# EAGLE design stimMod (EAGLE 8.0.1)
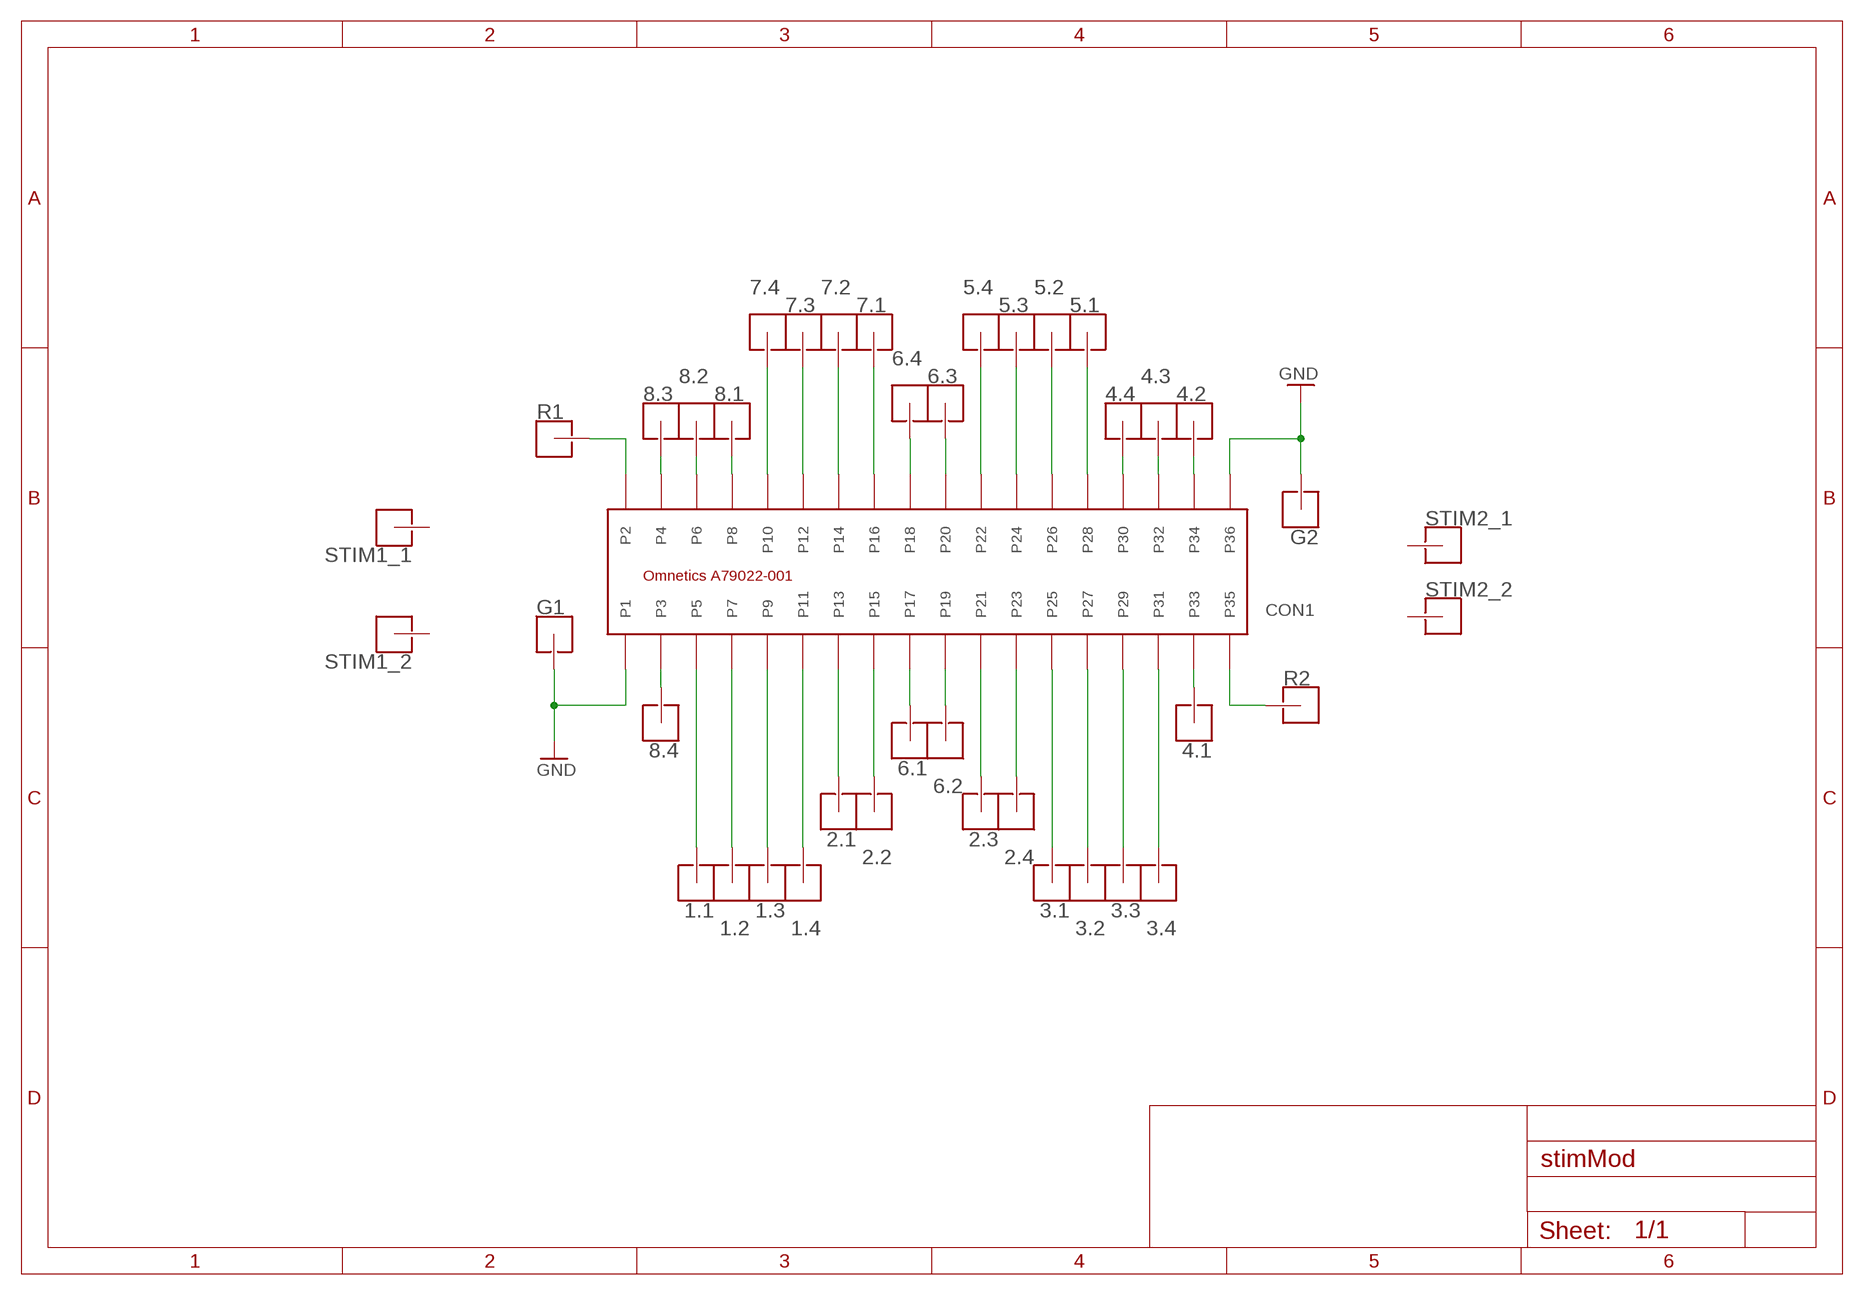
[diagram p0: schematic, sheet 1]

## Parts
1.1  HOLE_L_G_PIN_V5  [LARGE_GOLD_PIN_V5]
1.2  HOLE_L_G_PIN_V5  [LARGE_GOLD_PIN_V5]
1.3  HOLE_L_G_PIN_V5  [LARGE_GOLD_PIN_V5]
1.4  HOLE_L_G_PIN_V5  [LARGE_GOLD_PIN_V5]
2.1  HOLE_L_G_PIN_V5  [LARGE_GOLD_PIN_V5]
2.2  HOLE_L_G_PIN_V5  [LARGE_GOLD_PIN_V5]
2.3  HOLE_L_G_PIN_V5  [LARGE_GOLD_PIN_V5]
2.4  HOLE_L_G_PIN_V5  [LARGE_GOLD_PIN_V5]
3.1  HOLE_L_G_PIN_V5  [LARGE_GOLD_PIN_V5]
3.2  HOLE_L_G_PIN_V5  [LARGE_GOLD_PIN_V5]
3.3  HOLE_L_G_PIN_V5  [LARGE_GOLD_PIN_V5]
3.4  HOLE_L_G_PIN_V5  [LARGE_GOLD_PIN_V5]
4.1  HOLE_L_G_PIN_V5  [LARGE_GOLD_PIN_V5]
4.2  HOLE_L_G_PIN_V5  [LARGE_GOLD_PIN_V5]
4.3  HOLE_L_G_PIN_V5  [LARGE_GOLD_PIN_V5]
4.4  HOLE_L_G_PIN_V5  [LARGE_GOLD_PIN_V5]
5.1  HOLE_L_G_PIN_V5  [LARGE_GOLD_PIN_V5]
5.2  HOLE_L_G_PIN_V5  [LARGE_GOLD_PIN_V5]
5.3  HOLE_L_G_PIN_V5  [LARGE_GOLD_PIN_V5]
5.4  HOLE_L_G_PIN_V5  [LARGE_GOLD_PIN_V5]
6.1  HOLE_L_G_PIN_V5  [LARGE_GOLD_PIN_V5]
6.2  HOLE_L_G_PIN_V5  [LARGE_GOLD_PIN_V5]
6.3  HOLE_L_G_PIN_V5  [LARGE_GOLD_PIN_V5]
6.4  HOLE_L_G_PIN_V5  [LARGE_GOLD_PIN_V5]
7.1  HOLE_L_G_PIN_V5  [LARGE_GOLD_PIN_V5]
7.2  HOLE_L_G_PIN_V5  [LARGE_GOLD_PIN_V5]
7.3  HOLE_L_G_PIN_V5  [LARGE_GOLD_PIN_V5]
7.4  HOLE_L_G_PIN_V5  [LARGE_GOLD_PIN_V5]
8.1  HOLE_L_G_PIN_V5  [LARGE_GOLD_PIN_V5]
8.2  HOLE_L_G_PIN_V5  [LARGE_GOLD_PIN_V5]
8.3  HOLE_L_G_PIN_V5  [LARGE_GOLD_PIN_V5]
8.4  HOLE_L_G_PIN_V5  [LARGE_GOLD_PIN_V5]
CON1  A79022-001_MALESMD  [A79026-001_MALE]
G1  HOLE_L_G_PIN_V5  [LARGE_GOLD_PIN_V5]
G2  HOLE_L_G_PIN_V5  [LARGE_GOLD_PIN_V5]
R1  HOLE_L_G_PIN_V5  [LARGE_GOLD_PIN_V5]
R2  HOLE_L_G_PIN_V5  [LARGE_GOLD_PIN_V5]
STIM1_1  HOLE_L_G_PIN_V5  [LARGE_GOLD_PIN_V5]
STIM1_2  HOLE_L_G_PIN_V5  [LARGE_GOLD_PIN_V5]
STIM2_1  HOLE_L_G_PIN_V5  [LARGE_GOLD_PIN_V5]
STIM2_2  HOLE_L_G_PIN_V5  [LARGE_GOLD_PIN_V5]

## Nets
GND: CON1.P1 CON1.P36 G1.P$1 G2.P$1
N$1: 1.1.P$1 CON1.P5
N$2: 1.2.P$1 CON1.P7
N$3: 1.3.P$1 CON1.P9
N$4: 4.1.P$1 CON1.P33
N$5: 4.3.P$1 CON1.P32
N$6: 4.2.P$1 CON1.P34
N$7: 1.4.P$1 CON1.P11
N$8: 4.4.P$1 CON1.P30
N$9: 6.1.P$1 CON1.P17
N$10: 6.2.P$1 CON1.P19
N$11: 6.3.P$1 CON1.P20
N$12: 7.3.P$1 CON1.P12
N$13: 2.1.P$1 CON1.P13
N$14: 2.2.P$1 CON1.P15
N$15: 2.3.P$1 CON1.P21
N$16: 2.4.P$1 CON1.P23
N$17: 3.1.P$1 CON1.P25
N$18: 3.2.P$1 CON1.P27
N$19: 3.3.P$1 CON1.P29
N$20: 3.4.P$1 CON1.P31
N$21: 6.4.P$1 CON1.P18
N$22: 8.4.P$1 CON1.P3
N$23: 8.3.P$1 CON1.P4
N$24: 8.2.P$1 CON1.P6
N$25: 8.1.P$1 CON1.P8
N$26: 7.2.P$1 CON1.P14
N$27: 7.1.P$1 CON1.P16
N$28: 7.4.P$1 CON1.P10
N$29: 5.1.P$1 CON1.P28
N$30: 5.2.P$1 CON1.P26
N$31: 5.4.P$1 CON1.P22
N$32: 5.3.P$1 CON1.P24
N$34: CON1.P2 R1.P$1
N$35: CON1.P35 R2.P$1
Unconnected: STIM1_1.P$1 STIM1_2.P$1 STIM2_1.P$1 STIM2_2.P$1

## Library data of the parts
1.1-1.4 2.1-2.4 3.1-3.4 4.1-4.4 5.1-5.4 6.1-6.4 7.1-7.4 8.1-8.4 G1 G2 R1 R2 STIM1_1 STIM1_2 STIM2_1 STIM2_2 = holes:HOLE
CON1 = omnetics:A79022-001_MALE

## Board
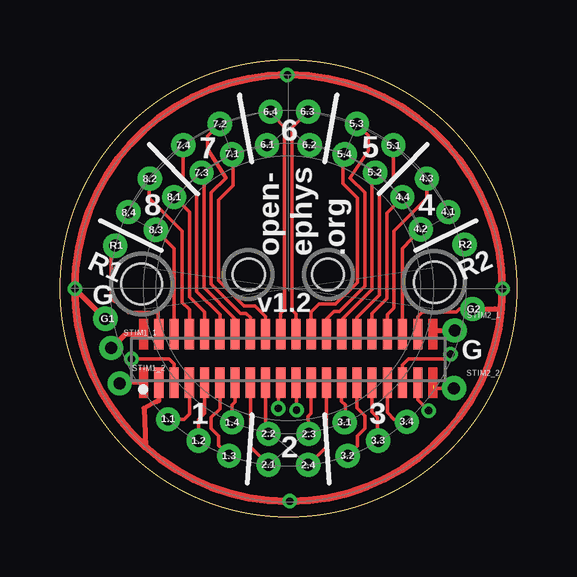
[diagram p1: board, top side]
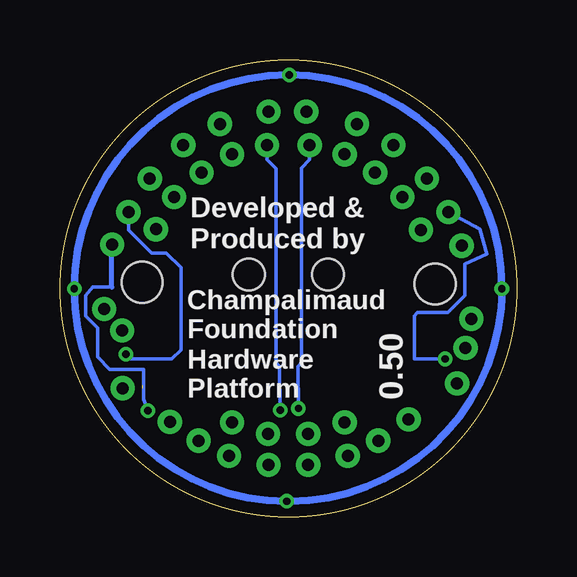
[diagram p2: board, bottom side, seen from below]

Size 19.05 x 19.05 mm. Coordinates in mm from the lower left corner, seen from the top.
Outline: circle at 9.53,9.53 radius 9.53
Copper layers (1*16): Top 0.035mm / dielectric 1.5mm / Bottom 0.035mm
Design rules "SeeedStudio_2layer_DRU_no_angle_20140221": minimum track width 6mil, minimum drill 12mil, track to track 6mil, track to pad 6mil, pad to pad 6mil, via to via 6mil, smd to smd 0mil, copper to edge 10mil, drill to drill 10mil, minimum pad ring 10mil, minimum via ring 6mil, stop-mask expansion 2mil, vias tented up to drill 100mil, thermal gap 10mil
Holes 1.32 mm at 7.87,10.1 11.18,10.1
Holes 1.7 mm at 3.4,9.7 15.62,9.78

### Footprints (pad centres in the part's own frame; a part is rotated, then mirrored left to right if it is on the bottom)
LARGE_GOLD_PIN_V5 = drill 0.5 pad 0.8: P$1 0,0
A79026-001_MALE = smd 0.381 x 1.27: P1 -5.397,-1.016; P2 -5.397,1.016; P3 -4.763,-1.016; P4 -4.763,1.016; P5 -4.128,-1.016; P6 -4.128,1.016; P7 -3.493,-1.016; P8 -3.493,1.016; P9 -2.857,-1.016; P10 -2.857,1.016; P11 -2.223,-1.016; P12 -2.223,1.016; P13 -1.587,-1.016; P14 -1.587,1.016; P15 -0.953,-1.016; P16 -0.953,1.016; P17 -0.318,-1.016; P18 -0.318,1.016; P19 0.318,-1.016; P20 0.318,1.016; P21 0.953,-1.016; P22 0.953,1.016; P23 1.587,-1.016; P24 1.587,1.016; P25 2.223,-1.016; P26 2.223,1.016; P27 2.857,-1.016; P28 2.857,1.016; P29 3.493,-1.016; P30 3.493,1.016; P31 4.128,-1.016; P32 4.128,1.016; P33 4.763,-1.016; P34 4.763,1.016; P35 5.397,-1.016; P36 5.397,1.016

### Placement (x,y rotation side)
1.1  4.51,4.06 0 top
1.2  5.78,3.17 0 top
1.3  7.05,2.54 0 top
1.4  7.18,3.94 0 top
2.1  8.7,2.16 0 top
2.2  8.7,3.45 0 top
2.3  10.38,3.45 0 top
2.4  10.35,2.16 0 top
3.1  11.87,3.94 90 top
3.2  12,2.54 90 top
3.3  13.27,3.17 90 top
3.4  14.47,3.96 90 top
4.1  16.19,12.7 270 top
4.2  15.05,11.99 0 top
4.3  15.3,14.1 270 top
4.4  14.29,13.33 0 top
5.1  13.91,15.49 90 top
5.2  13.14,14.35 90 top
5.3  12.38,16.38 90 top
5.4  11.87,15.11 90 top
6.1  8.64,15.49 270 top
6.2  10.41,15.49 0 top
6.3  10.35,16.89 270 top
6.4  8.78,16.89 0 top
7.1  7.18,15.11 270 top
7.2  6.67,16.38 0 top
7.3  5.91,14.35 0 top
7.4  5.14,15.49 0 top
8.1  4.76,13.33 0 top
8.2  3.75,14.1 0 top
8.3  4,11.96 0 top
8.4  2.86,12.7 0 top
CON1  9.53,6.6 0 top
G1  1.89,8.25 0 top
G2  17.21,8.66 0 top
R1  2.3,11.3 0 top
R2  16.88,11.35 0 top
STIM1_1  2.13,7.04 0 top
STIM1_2  2.49,5.56 0 top
STIM2_1  16.46,7.77 0 top
STIM2_2  16.43,5.36 0 top

### Tracks (layer width: path | path; a pad name or v marks a point on that pad's centre or on a via)
GND  (via drill 0.3)
  Top 0.152: 14.92,7.75 14.92,8.34 15.11,8.53 16.54,8.53 16.66,8.66 G2.P$1
  Top 0.203: 14.92,7.75 CON1.P36 | 9.58,0.63 v9.59,0.65 | v9.47,18.44 v9.49,18.43 | CON1.P1 4.11,5.83 4.11,4.85 4.04,4.8 3.5,4.52 3.56,2.92 | G2.P$1 18.12,8.67 18.45,8.67 v18.45,9.51 | v0.62,9.51 G1.P$1
  Top 0.305: 3.56,2.92 arc42 9.49,0.65 v9.59,0.65 arc90 v18.45,9.51 arc90 9.54,18.43 v9.49,18.43 arc90 0.62,9.56 v0.62,9.51 arc48 3.56,2.92
  Bottom 0.203: 0.61,9.52 0.77,11.12 0.98,11.96
  Bottom 0.305: v0.62,9.51 0.62,9.56 arc-90 v9.49,18.43 9.54,18.43 arc-90 v18.45,9.51 arc-90 v9.59,0.65 9.49,0.65 arc-90 0.61,9.52
N$1
  Top 0.152: CON1.P5 5.4,4.29 5.17,4.06 1.1.P$1
N$2
  Top 0.152: CON1.P7 6.03,4.32 5.78,4.06 1.2.P$1
N$3
  Top 0.152: CON1.P9 6.67,4.5 6.31,4.14 6.31,3.68 6.62,3.38 6.62,2.97 1.3.P$1
N$4  (via drill 0.3)
  Top 0.152: CON1.P33 14.29,6.32 14.54,6.58 16.09,6.58 v16.29,6.78
  Bottom 0.152: 4.1.P$1 16.19,11.96 15.23,11 14.62,11 14.01,10.39 14.01,6.96 14.39,6.58 16.09,6.58 v16.29,6.78
N$5
  Top 0.152: CON1.P32 13.65,8.43 13.93,8.71 13.93,11.91 15.3,13.28 4.3.P$1
N$6
  Top 0.152: CON1.P34 14.29,11.18 4.2.P$1
N$7
  Top 0.152: CON1.P11 7.3,4.79 7.17,4.66 1.4.P$1
N$8
  Top 0.152: CON1.P30 13.02,8.48 13.63,9.09 13.63,12.67 4.4.P$1
N$9  (via drill 0.3)
  Top 0.152: v9.11,4.52 9.13,5.51 CON1.P17
  Bottom 0.152: v9.11,4.52 9.13,6.27 8.98,6.43 8.98,14.54 8.64,14.88 6.1.P$1
N$10  (via drill 0.3)
  Top 0.152: v9.87,4.44 9.89,5.54 CON1.P19
  Bottom 0.152: v9.87,4.44 9.89,6.27 10.05,6.43 10.05,14.52 10.41,14.88 6.2.P$1
N$11
  Top 0.152: 6.3.P$1 9.68,16.22 9.68,8.62 9.84,8.46 CON1.P20
N$12
  Top 0.152: CON1.P12 7.3,8.25 6.01,9.55 6.01,14.25 7.3.P$1
N$13
  Top 0.152: CON1.P13 7.94,2.92 2.1.P$1
N$14
  Top 0.152: 8.7,3.56 2.2.P$1 8.57,3.58 CON1.P15
N$15
  Top 0.152: CON1.P21 10.48,4.3 10.35,4.18 2.3.P$1
N$16
  Top 0.152: CON1.P23 11.11,2.92 2.4.P$1
N$17
  Top 0.152: CON1.P25 11.75,4.81 11.9,4.66 11.9,3.96 3.1.P$1
N$18
  Top 0.152: CON1.P27 12.38,4.55 12.71,4.22 12.71,3.68 12.41,3.38 12.41,2.95 3.2.P$1
N$19
  Top 0.152: CON1.P29 13.02,4.37 13.25,4.14 13.25,3.2 3.3.P$1
N$20
  Top 0.152: CON1.P31 13.65,4.34 13.93,4.06 3.4.P$1
N$21
  Top 0.152: 6.4.P$1 9.37,16.22 9.37,8.65 9.21,8.48 CON1.P18
N$22  (via drill 0.3)
  Top 0.152: CON1.P3 4.76,6.37 4.56,6.58 v2.98,6.58
  Bottom 0.152: 2.88,12.67 8.4.P$1 1.55,11.99 1.24,10.95 2.16,10.54 2.16,9.22 2.87,8.51 4.14,8.51 4.27,8.38 4.27,6.58 v2.98,6.58
N$23
  Top 0.152: CON1.P4 4.76,11.18 8.3.P$1
N$24
  Top 0.152: CON1.P6 5.4,8.64 5.09,8.94 5.09,11.91 3.72,13.28 3.72,14.07 8.2.P$1
N$25
  Top 0.152: CON1.P8 6.03,8.53 5.4,9.17 5.4,12.7 8.1.P$1
N$26
  Top 0.152: CON1.P14 7.94,8.31 7.76,8.48 7.53,8.48 6.31,9.7 6.31,13.51 6.92,14.12 6.16,15.34 6.16,15.87 7.2.P$1
N$27
  Top 0.152: CON1.P16 8.57,8.36 8.14,8.79 7.68,8.79 6.62,9.85 6.62,13.21 7.23,13.82 7.23,15.06 7.1.P$1
N$28
  Top 0.152: CON1.P10 6.67,8.43 5.7,9.4 5.7,13.51 5.14,14.07 7.4.P$1
N$29
  Top 0.152: CON1.P28 12.38,8.31 13.32,9.25 13.32,13.44 13.91,14.02 5.1.P$1
N$30
  Top 0.152: CON1.P26 11.75,8.2 13.02,9.47 13.02,14.22 5.2.P$1
N$31
  Top 0.152: CON1.P22 10.48,8.53 10.81,8.86 11.49,8.86 12.41,9.78 12.41,13.28 11.8,13.89 11.8,15.04 5.4.P$1
N$32
  Top 0.152: CON1.P24 11.11,8.25 11.42,8.56 11.65,8.56 12.71,9.63 12.71,13.51 12.1,14.12 12.86,15.26 12.86,15.9 5.3.P$1
N$33
  Top 0.152: 16.41,5.36 15.6,5.36
N$34
  Top 0.152: CON1.P2 4.11,7.62 4.09,8.51 2.84,8.51 2.35,8.98 arc-90 2.13,9.19 2.13,11.09 R1.P$1
N$35  (via drill 0.3)
  Top 0.152: CON1.P35 14.92,4.88 v15.38,4.42
  Bottom 0.152: v15.38,4.42 15.57,4.89 15.57,6.15 16.97,6.15 17.47,6.65 17.47,7.87 17.98,8.38 17.98,9.22 17.68,9.58 16.89,9.58
  Bottom 0.203: 16.78,11.23 R2.P$1 16.89,11.11 16.89,9.58 | 15.23,4.55 v15.38,4.42
N$37
  Top 0.203: 2.13,7.01 2.74,7.62 3.43,7.62
N$38
  Top 0.203: 3.45,5.59 2.59,5.61
N$39  (1 unrouted)
N$41
  Top 0.203: 15.47,7.77 16.43,7.77
(copper drawn outside any net)
  shapes: Top area x4

### Text on the board
tPlace: 6 | 7 | 5 | 8 | 4 | R1 | open- / ephys / .org | R2 | G | v1.2 | G | 1 | 3 | 2
bPlace: Developed & / Produced by | Champalimaud / Foundation | 0.50 | Hardware / Platform